# EasyEDA Pro project can-mcu.eprj, board host-network-display
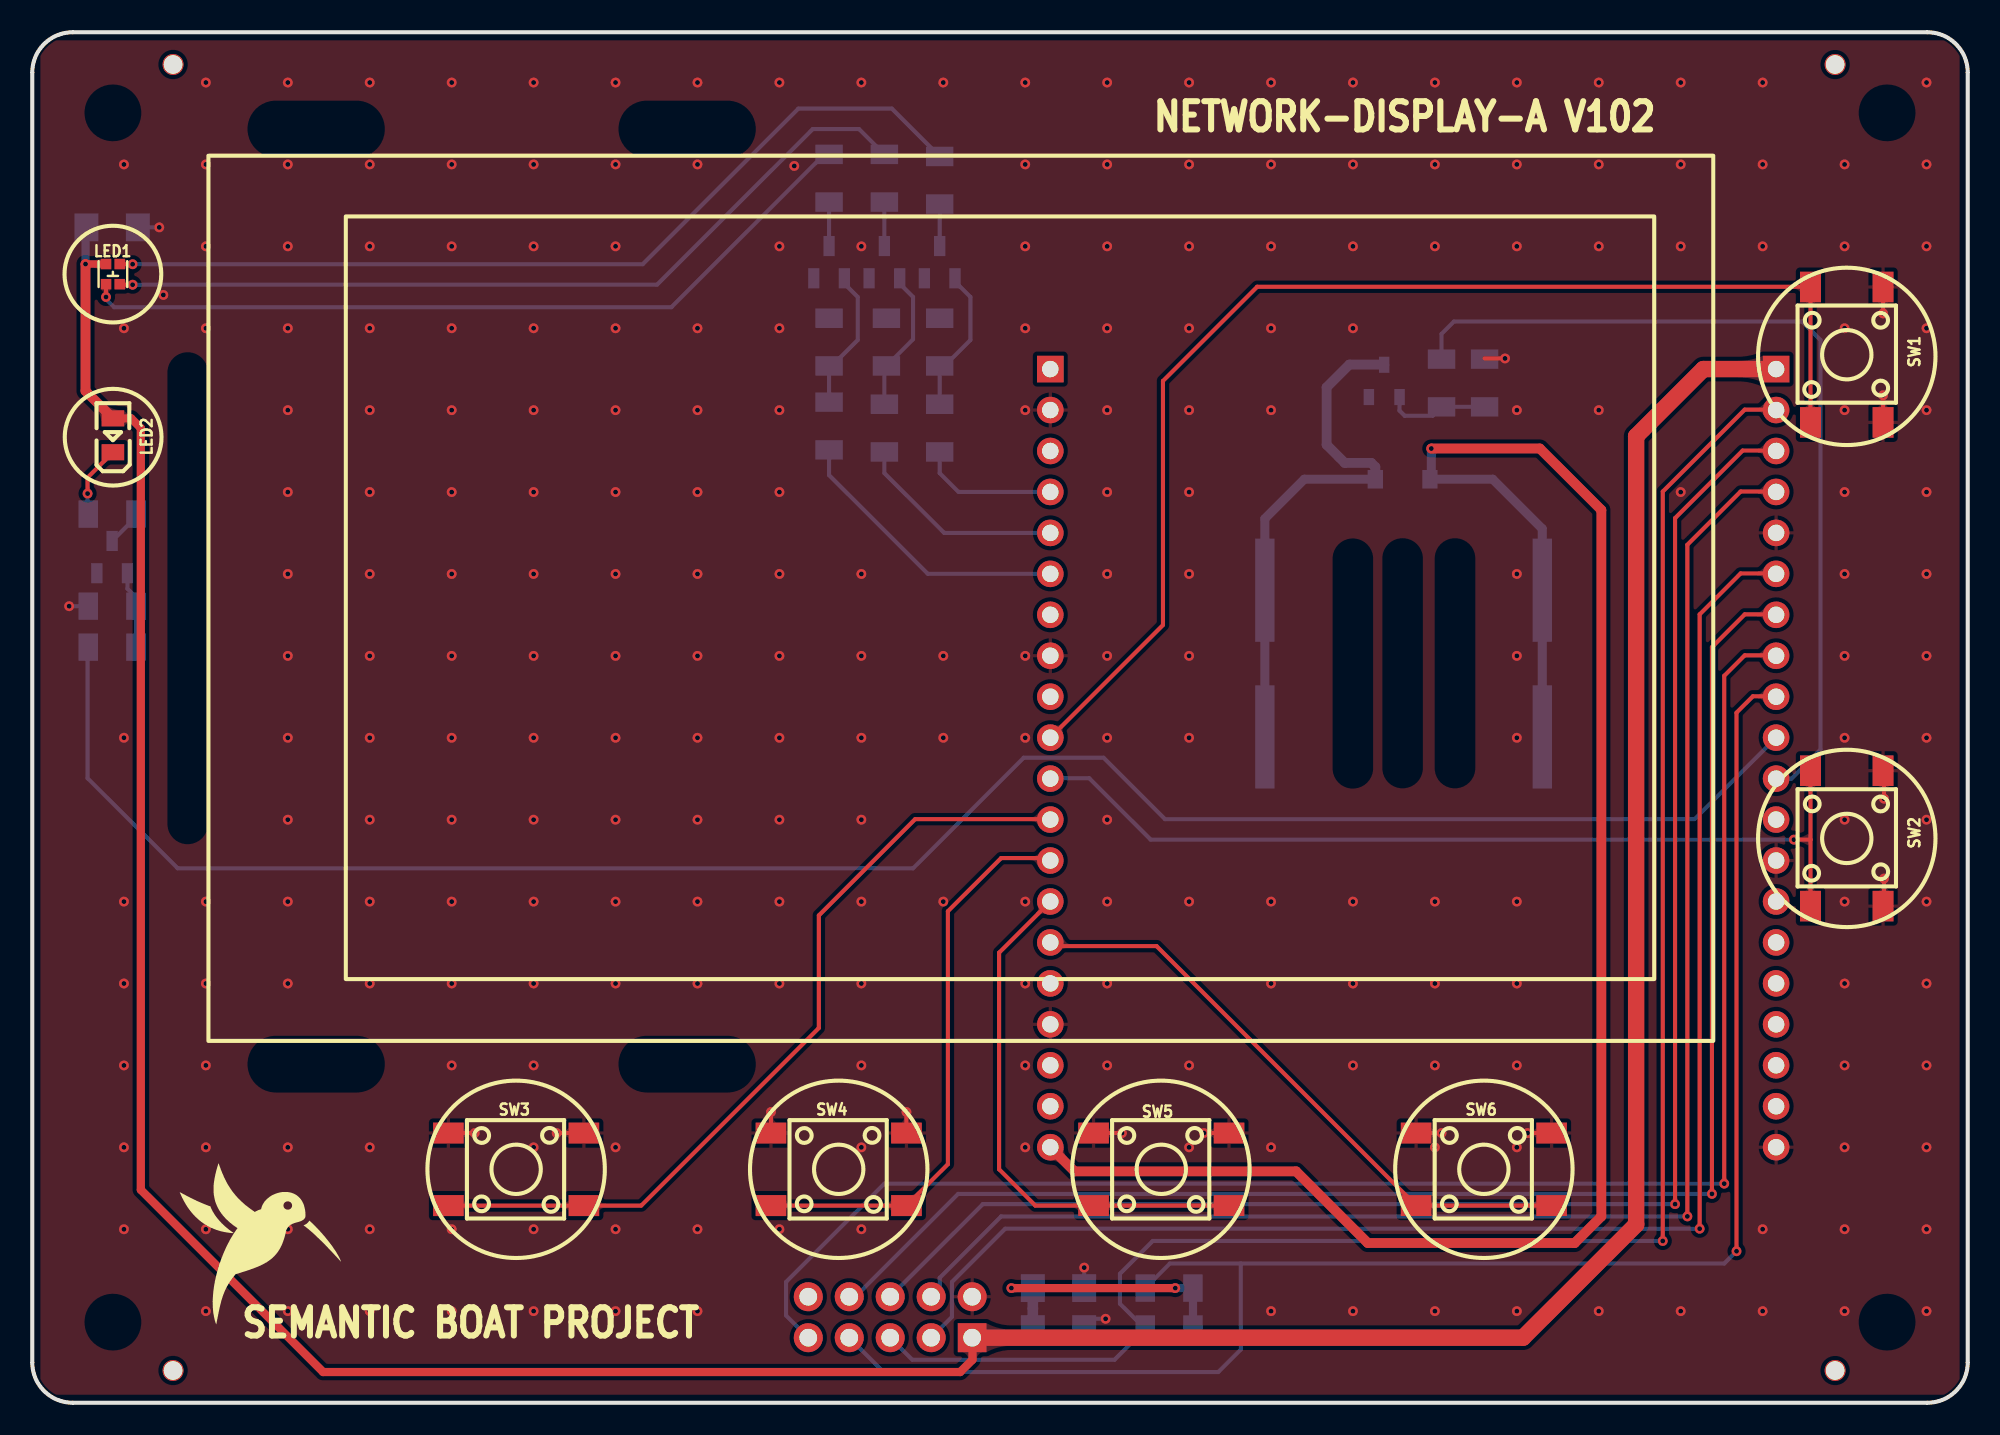
[diagram p9: board, top side]
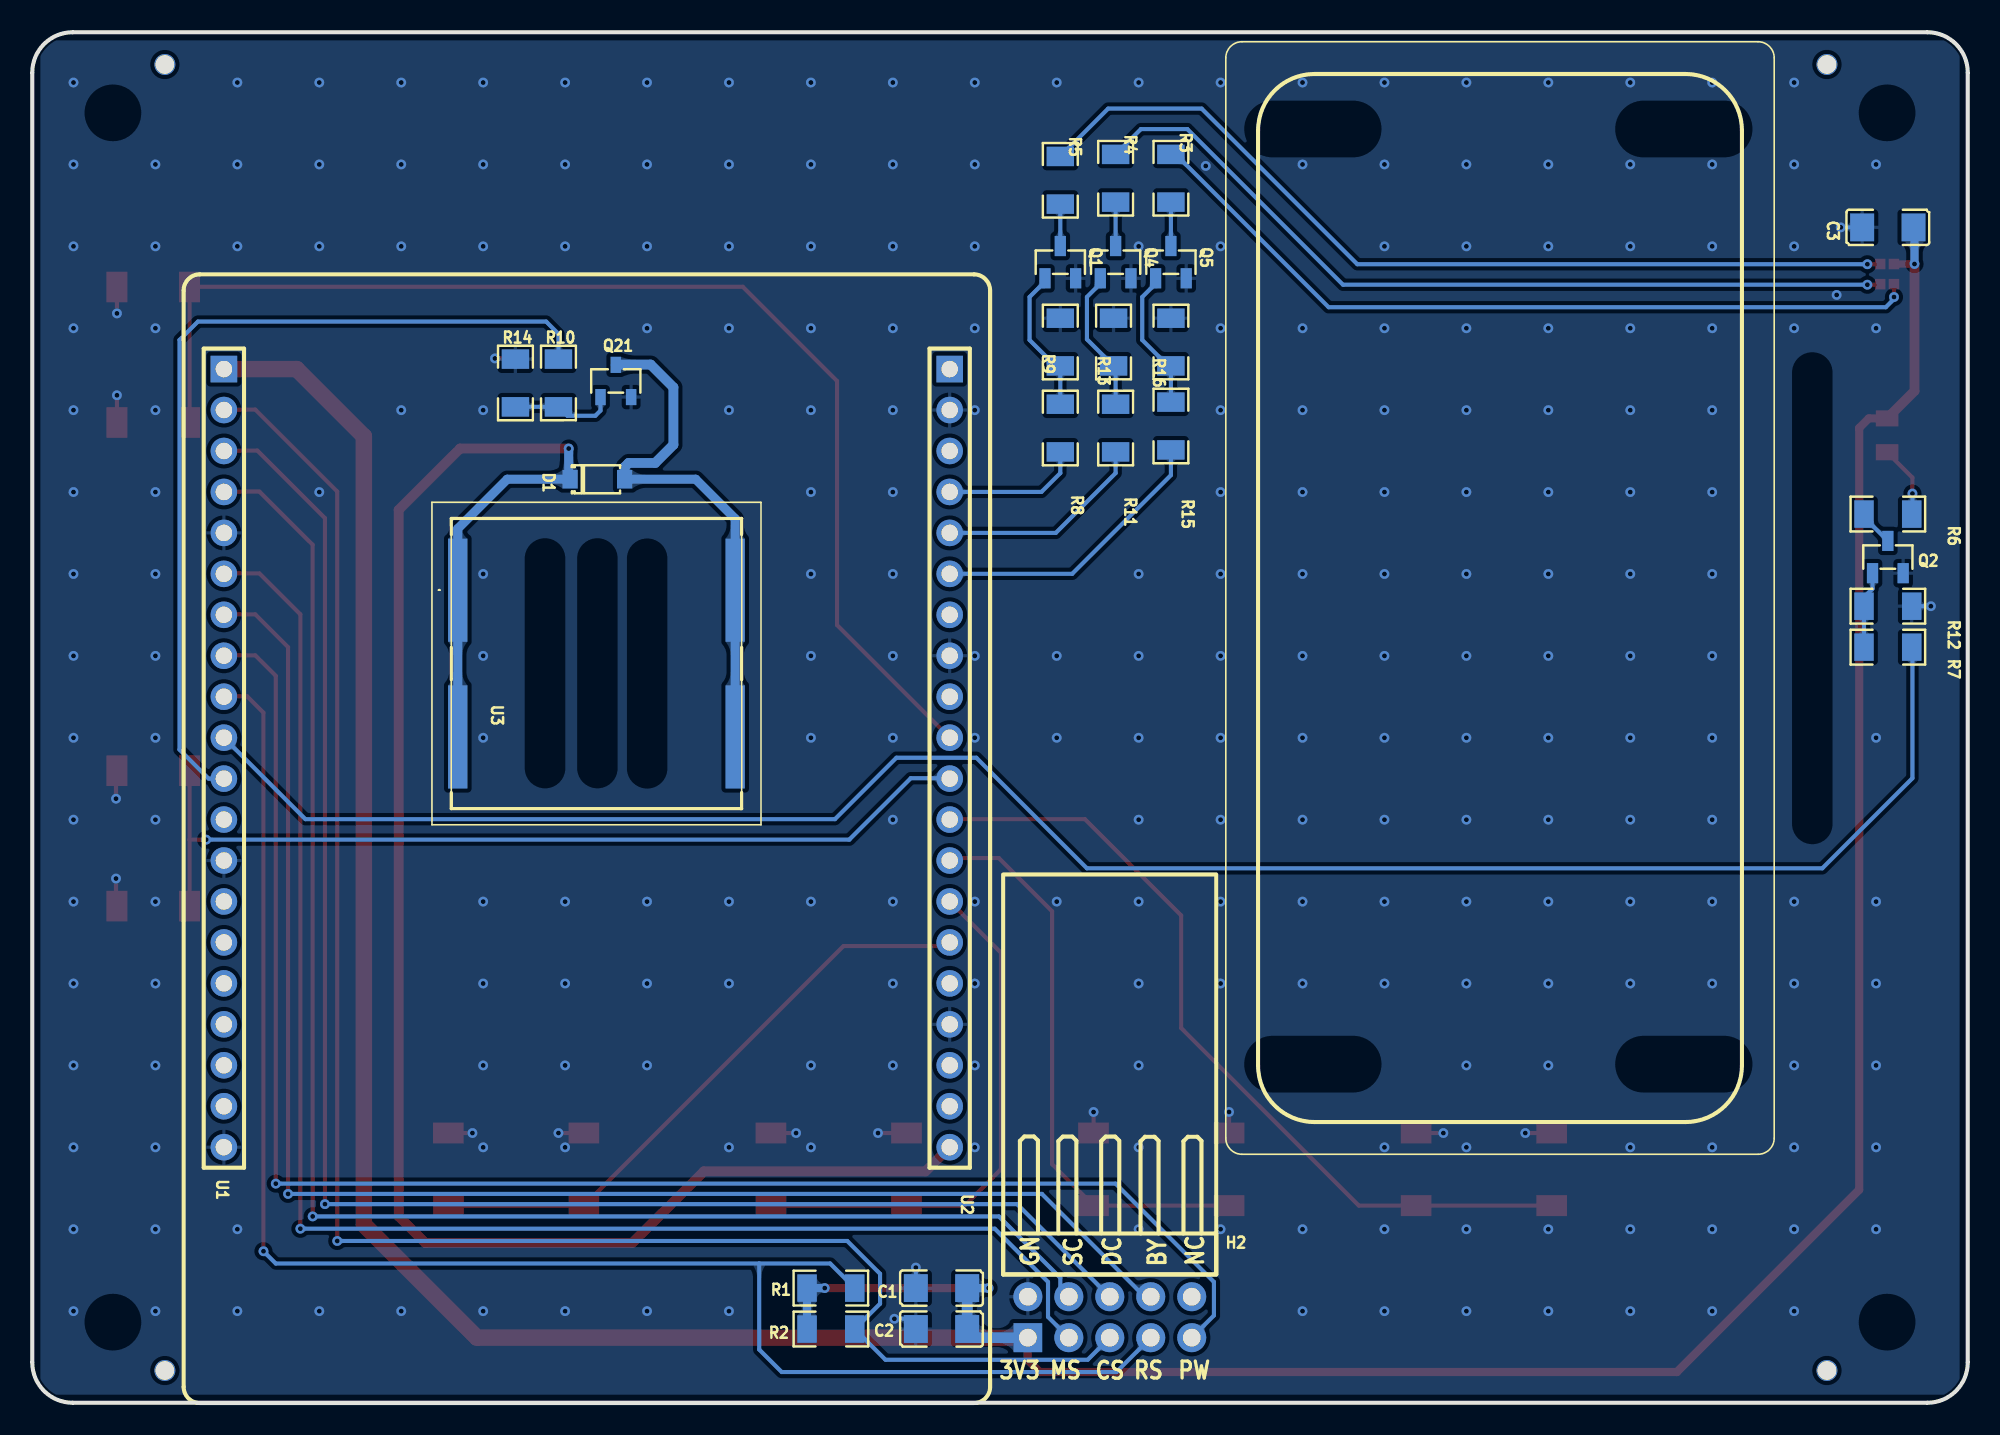
[diagram p10: board, bottom side, seen from below]

Outline 120 x 85 mm; copper layers: Top Layer, Inner1, Inner2, Bottom Layer. Coordinates in mm from the lower left corner of the outline.
Outline path: 0,82.5 0,2.5 arc(0.73,0.73) 2.5,0 117.5,0 arc(119.27,0.73) 120,2.5 120,82.5 arc(119.27,84.27) 117.5,85 2.5,85 arc(0.73,84.27) 0,82.5
Stack: Top Layer 0.035mm Outer layer thickness 1oz / Dielectric1 0.2104mm 7628 RC49% 8.6mil / Inner1 0.0152mm Inner layer thickness / Dielectric2 1.065mm 1.1mm H/HOZ Copper / Inner2 0.0152mm Inner layer thickness / Dielectric3 0.2104mm 7628 RC49% 8.6mil / Bottom Layer 0.035mm Outer layer thickness 1oz

## Design rules (mm)
template: JLCPCB Capability(Two Layers Board)
spacing copperThickness1oz (default): track to track 0.102, other pairs 0.152 to 0.3
spacing copperThickness2oz: track to track 0.203, other pairs 0.152 to 0.3
track width copperThickness1oz (default): min 0.127, default 0.254, max 2.54
track width copperThickness2oz: min 0.203, default 0.254, max 2.54
differential pair differentialPair (default): width min 0.127, default 0.254, max 2.54; gap min 0.152, default 0.152
via viaSize (default): diameter min 0.5, default 0.61, max 10; hole min 0.3, default 0.305, max 6.3

## Placement (name value [footprint] x y rotation side)
C1  100nF  [C1206]  63.63 7.11 0 bottom
C2  22uF  [C1206]  63.63 4.57 0 bottom
C3  100nF  [C1206]  4.95 72.9 0 bottom
D1  1N4148W  [SOD-123_L2.8-W1.8-LS3.7-RD]  84.96 57.28 180 bottom
H2  PZ254R-12-10P  [HDR-TH_10P-P2.54-H-M-R2-C5-S2.54]  53.19 5.31 180 bottom
LED1  SZYY1615RGB-B 4pin  [LED-SMD_4P-L1.6-W1.5-TR-1]  5 70 0 top
LED2  KT-0805G  [LED0805-R-RD]  5 60 90 top
NOREF  -  [Pad_e112]  111.78 83 0 top
NOREF#2  -  [Pad_e111]  111.78 2 0 top
NOREF#3  -  [Pad_e96]  8.73 2 0 top
NOREF#4  -  [Pad_e110]  8.73 83 0 top
Q1  2N7002  [SOT-23-3_L2.9-W1.3-P1.90-LS2.4-BR]  56.26 70.74 270 bottom
Q2  2N7002  [SOT-23-3_L2.9-W1.3-P1.90-LS2.4-BR]  4.95 52.45 270 bottom
Q4  2N7002  [SOT-23-3_L2.9-W1.3-P1.90-LS2.4-BR]  52.83 70.74 270 bottom
Q5  2N7002  [SOT-23-3_L2.9-W1.3-P1.90-LS2.4-BR]  49.4 70.74 270 bottom
Q21  AO3400A  [SOT-23-3_L2.9-W1.3-P1.90-LS2.4-BR#2]  83.82 63.37 270 bottom
R1  10kΩ  [R1206]  70.49 7.11 0 bottom
R2  10kΩ  [R1206]  70.49 4.57 0 bottom
R3  100Ω  [R1206]  49.4 75.95 90 bottom
R4  100Ω  [R1206]  52.83 75.95 90 bottom
R5  150Ω  [R1206]  56.26 75.82 90 bottom
R6  100Ω  [R1206]  4.95 55.12 180 bottom
R7  100Ω  [R1206]  4.95 46.86 180 bottom
R8  100Ω  [R1206]  56.26 60.45 270 bottom
R9  100kΩ  [R1206]  56.26 65.79 90 bottom
R10  220Ω  [R1206]  87.38 63.25 270 bottom
R11  100Ω  [R1206]  52.83 60.45 90 bottom
R12  100kΩ  [R1206]  4.95 49.4 180 bottom
R13  100kΩ  [R1206]  52.96 65.79 90 bottom
R14  47kΩ  [R1206]  90.04 63.25 270 bottom
R15  100Ω  [R1206]  49.4 60.58 90 bottom
R16  100kΩ  [R1206]  49.4 65.79 90 bottom
SW1  TS-1002S-05026C  [KEY-SMD_4P-L6.0-W6.0-P4.50-LS9.0]  112.5 65 270 top
SW2  TS-1002S-05026C  [KEY-SMD_4P-L6.0-W6.0-P4.50-LS9.0]  112.5 35 270 top
SW3  TS-1002S-05026C  [KEY-SMD_4P-L6.0-W6.0-P4.50-LS9.0]  30 14.48 0 top
SW4  TS-1002S-05026C  [KEY-SMD_4P-L6.0-W6.0-P4.50-LS9.0]  50 14.48 0 top
SW5  TS-1002S-05026C  [KEY-SMD_4P-L6.0-W6.0-P4.50-LS9.0]  70 14.48 0 top
SW6  TS-1002S-05026C  [KEY-SMD_4P-L6.0-W6.0-P4.50-LS9.0]  90 14.48 0 top
U1  KH-2.54FH-1X20P-H8.5  [HDR-TH_20P-P2.54-V-F-2]  108.12 39.98 270 bottom
U2  KH-2.54FH-1X20P-H8.5  [HDR-TH_20P-P2.54-V-F-2]  63.12 39.98 270 bottom
U3  PKMCS1818E20A0-R1  [PKMCS1818E20A0R1]  85.02 45.85 180 bottom

## Footprints (pads in the part's own frame, mm; a bottom-side part is the same pattern mirrored in y, then rotated)
C1206
  rect 1.485x1.728 smd: 1(-1.593,0) 2(1.593,0)
HDR-TH_10P-P2.54-H-M-R2-C5-S2.54
  rect 1.778x1.8 hole 1.1: 1(-5.08,-1.27)
  round 1.8 hole 1.1: 2(-5.08,1.27) 3(-2.54,-1.27) 4(-2.54,1.27) 5(0,-1.27) 6(0,1.27) 7(2.54,-1.27) 8(2.54,1.27) 9(5.08,-1.27) 10(5.08,1.27)
HDR-TH_20P-P2.54-V-F-2
  rect 1.65x1.65 hole 1.02: 1(-24.13,0)
  round 1.65 hole 1.02: 2(-21.59,0) 3(-19.05,0) 4(-16.51,0) 5(-13.97,0) 6(-11.43,0) 7(-8.89,0) 8(-6.35,0) 9(-3.81,0) 10(-1.27,0) 11(1.27,0) 12(3.81,0) 13(6.35,0) 14(8.89,0) 15(11.43,0) 16(13.97,0) 17(16.51,0) 18(19.05,0) 19(21.59,0) 20(24.13,0)
KEY-SMD_4P-L6.0-W6.0-P4.50-LS9.0
  rect 1.9x1.3 smd: 1(-4.2,2.25) 2(4.2,2.25) 3(-4.2,-2.25) 4(4.2,-2.25)
LED0805-R-RD
  rect 1x1.399 smd: 1(1.05,0) 2(-1.05,0)
LED-SMD_4P-L1.6-W1.5-TR-1
  rect 0.65x0.65 smd: 1(0.425,0.625) 2(0.425,-0.625) 3(-0.425,-0.625) 4(-0.425,0.625)
Pad_e96
  round 1.3 hole 1.152: 1(0,0)
Pad_e110
  round 1.3 hole 1.152: 1(0,0)
Pad_e111
  round 1.3 hole 1.152: 1(0,0)
Pad_e112
  round 1.3 hole 1.152: 1(0,0)
PKMCS1818E20A0R1
  rect 1.2x6.4 smd: 1(-8.6,4.55) 2(-8.6,-4.55) 3(8.6,-4.55) 4(8.6,4.55)
R1206
  rect 1.208x1.701 smd: 1(-1.479,0) 2(1.479,0)
SOD-123_L2.8-W1.8-LS3.7-RD
  rect 0.95x1.15 smd: 1(-1.692,0) 2(1.692,0)
SOT-23-3_L2.9-W1.3-P1.90-LS2.4-BR
  rect 1.25x0.7 smd: 1(1,-0.95) 2(1,0.95) 3(-1,0)
SOT-23-3_L2.9-W1.3-P1.90-LS2.4-BR#2
  rect 1x0.65 smd: 1(1,-0.95) 2(1,0.95) 3(-1,0)

## Nets
As in the schematic.

Pads without a net: H2 10; NOREF 1; NOREF#2 1; NOREF#3 1; NOREF#4 1; U1 12 14 15 16 17 18 19; U2 1 3 7 9 16 18 19

## Via types
v1: diameter 0.61, hole 0.305, Top Layer to Bottom Layer, 288 vias

## Routing (per net, layer and track width the routed paths; a pad name or vN(x,y) marks a point on that pad's centre or on a via; arc(x,y) is an arc through that point)
+3V3: length 246
  Top Layer w0.457: LED1.4 v1(3.3,70.62)
  Top Layer w0.508: v1(70.87,7.11) v1(60.71,7.11) ; H2.1 58.29,4.02 58.29,2.67 57.53,1.91 18.03,1.91 6.73,13.21 6.73,60.45 6.13,61.05 LED2.1
  Top Layer w0.61: v1(3.3,70.62) 3.3,62.75 LED2.1
  Top Layer w1.016: H2.1 92.43,4.04 99.44,11.05 99.44,59.94 103.61,64.11 U1.1
  Bottom Layer w0.254: 62.04,5.84 62.03,5.85
  Bottom Layer w0.508: v1(3.3,70.62) 3.3,72.84 C3.1 ; R2.2 R1.2 v1(70.87,7.11) ; v1(60.71,7.11) C1.1
  Bottom Layer w0.66: H2.1 61.5,4.04 C2.1 C1.1
+12V: length 116.3
  Top Layer w0.61: U2.20 64.62,14.35 78.36,14.35 82.8,9.91 95.63,9.91 97.28,11.56 97.28,55.37 93.47,59.18 v1(86.74,59.18)
  Bottom Layer w0.559: U3.2 U3.1 93.62,54.21 90.55,57.28 D1.1 86.74,57.36 v1(86.74,59.18)
GND: length 25.8
  Top Layer w0.254: 90.04,64.77 v1(91.31,64.77) ; v1(114.81,32.51) 114.81,30.86 SW2.2 ; SW5.2 v1(72.64,16.73) ; v1(114.75,67.56) SW1.1 ; SW3.2 v1(32.51,16.73) ; SW3.1 v1(27.43,16.73) ; SW2.1 114.81,39.14 v1(114.81,37.47) ; SW4.1 v1(45.8,18.03) ; SW4.2 v1(54.2,18.03) ; SW6.2 v1(92.71,16.73) ; SW6.1 v1(87.38,16.73) ; v1(114.75,62.48) SW1.2 ; SW5.1 v1(67.56,16.73)
  Bottom Layer w0.254: C3.2 v1(7.87,72.9) ; v1(66.55,5.21) 65.85,5.21 C2.2 ; R12.2 v1(2.29,49.4) ; C1.2 v1(65.22,8.38)
  vias: v1(5.68,76.8) v1(5.68,66.64) v1(5.68,41.24) v1(5.68,31.08) v1(5.68,26) v1(5.68,20.92) v1(5.68,15.84) v1(5.68,10.76) v1(8.13,68.71) v1(10.76,81.88) v1(10.76,76.8) v1(10.76,71.72) v1(10.76,66.64) v1(10.76,31.08) v1(10.76,26) v1(10.76,20.92) v1(10.76,15.84) v1(10.76,10.76) v1(10.76,5.68) v1(15.84,81.88) v1(15.84,76.8) v1(15.84,71.72) v1(15.84,66.64) v1(15.84,61.56) v1(15.84,56.48) v1(15.84,51.4) v1(15.84,46.32) v1(15.84,41.24) v1(15.84,36.16) v1(15.84,31.08) v1(15.84,26) v1(15.84,15.84) v1(15.84,10.76) v1(15.84,5.68) v1(20.92,81.88) v1(20.92,76.8) v1(20.92,71.72) v1(20.92,66.64) v1(20.92,61.56) v1(20.92,56.48) v1(20.92,51.4) v1(20.92,46.32) v1(20.92,41.24) v1(20.92,36.16) v1(20.92,31.08) v1(20.92,26) v1(20.92,15.84) v1(20.92,10.76) v1(20.92,5.68) v1(26,81.88) v1(26,76.8) v1(26,71.72) v1(26,66.64) v1(26,61.56) v1(26,56.48) v1(26,51.4) v1(26,46.32) v1(26,41.24) v1(26,36.16) v1(26,31.08) v1(26,26) v1(26,20.92) v1(26,10.76) v1(26,5.68) v1(31.08,81.88) v1(31.08,76.8) v1(31.08,71.72) v1(31.08,66.64) v1(31.08,61.56) v1(31.08,56.48) v1(31.08,51.4) v1(31.08,46.32) v1(31.08,41.24) v1(31.08,36.16) v1(31.08,31.08) v1(31.08,26) v1(31.08,20.92) v1(31.08,15.84) v1(31.08,10.76) v1(31.08,5.68) v1(36.16,81.88) v1(36.16,76.8) v1(36.16,71.72) v1(36.16,66.64) v1(36.16,61.56) v1(36.16,56.48) v1(36.16,51.4) v1(36.16,46.32) v1(36.16,41.24) v1(36.16,36.16) v1(36.16,31.08) v1(36.16,26) v1(36.16,15.84) v1(36.16,10.76) v1(36.16,5.68) v1(41.24,81.88) v1(41.24,76.8) v1(41.24,66.64) v1(41.24,61.56) v1(41.24,56.48) v1(41.24,51.4) v1(41.24,46.32) v1(41.24,41.24) v1(41.24,36.16) v1(41.24,31.08) v1(41.24,26) v1(41.24,10.76) v1(41.24,5.68) v1(46.32,81.88) v1(46.32,71.72) v1(46.32,66.64) v1(46.32,61.56) v1(46.32,56.48) v1(46.32,51.4) v1(46.32,46.32) v1(46.32,41.24) v1(46.32,36.16) v1(46.32,31.08) v1(46.32,26) v1(46.32,10.76) v1(47.24,76.71) v1(51.4,81.88) v1(51.4,71.72) v1(51.4,51.4) v1(51.4,46.32) v1(51.4,41.24) v1(51.4,36.16) v1(51.4,31.08) v1(51.4,26) v1(51.4,20.92) v1(51.4,15.84) v1(51.4,10.76) v1(56.48,81.88) v1(56.48,46.32) v1(56.48,41.24) v1(56.48,31.08) v1(61.56,81.88) v1(61.56,76.8) v1(61.56,71.72) v1(61.56,66.64) v1(61.56,61.56) v1(61.56,46.32) v1(61.56,41.24) v1(61.56,31.08) v1(61.56,26) v1(61.56,20.92) v1(61.56,15.84) v1(66.64,81.88) v1(66.64,76.8) v1(66.64,71.72) v1(66.64,66.64) v1(66.64,61.56) v1(66.64,56.48) v1(66.64,51.4) v1(66.64,46.32) v1(66.64,41.24) v1(66.64,36.16) v1(66.64,31.08) v1(66.64,26) v1(66.64,20.92) v1(71.72,81.88) v1(71.72,76.8) v1(71.72,71.72) v1(71.72,66.64) v1(71.72,61.56) v1(71.72,56.48) v1(71.72,51.4) v1(71.72,46.32) v1(71.72,41.24) v1(71.72,31.08) v1(71.72,20.92) v1(71.72,15.84) v1(76.8,81.88) v1(76.8,76.8) v1(76.8,71.72) v1(76.8,66.64) v1(76.8,61.56) v1(76.8,31.08) v1(76.8,26) v1(76.8,15.84) v1(76.8,5.68) v1(81.88,81.88) v1(81.88,76.8) v1(81.88,71.72) v1(81.88,66.64) v1(81.88,31.08) v1(81.88,26) v1(81.88,20.92) v1(81.88,5.68) v1(86.96,81.88) v1(86.96,76.8) v1(86.96,71.72) v1(86.96,31.08) v1(86.96,26) v1(86.96,20.92) v1(86.96,15.84) v1(86.96,5.68) v1(92.04,81.88) v1(92.04,76.8) v1(92.04,71.72) v1(92.04,61.56) v1(92.04,51.4) v1(92.04,46.32) v1(92.04,41.24) v1(92.04,31.08) v1(92.04,26) v1(92.04,20.92) v1(92.04,15.84) v1(92.04,5.68) v1(97.12,81.88) v1(97.12,76.8) v1(97.12,71.72) v1(97.12,61.56) v1(97.12,5.68) v1(102.2,81.88) v1(102.2,76.8) v1(102.2,71.72) v1(102.2,56.48) v1(102.2,5.68) v1(107.28,81.88) v1(107.28,76.8) v1(107.28,71.72) v1(107.28,10.76) v1(107.28,5.68) v1(112.36,76.8) v1(112.36,71.72) v1(112.36,66.64) v1(112.36,61.56) v1(112.36,56.48) v1(112.36,51.4) v1(112.36,46.32) v1(112.36,41.24) v1(112.36,36.16) v1(112.36,31.08) v1(112.36,26) v1(112.36,20.92) v1(112.36,15.84) v1(112.36,10.76) v1(112.36,5.68) v1(117.44,81.88) v1(117.44,76.8) v1(117.44,71.72) v1(117.44,66.64) v1(117.44,61.56) v1(117.44,56.48) v1(117.44,51.4) v1(117.44,46.32) v1(117.44,41.24) v1(117.44,36.16) v1(117.44,31.08) v1(117.44,26) v1(117.44,20.92) v1(117.44,15.84) v1(117.44,10.76) v1(117.44,5.68)
BTN_FUN_0: length 76
  Top Layer w0.254: U2.10 70.1,48.23 70.1,63.37 75.95,69.22 110.24,69.22 SW1.3 SW1.4
BTN_FUN_1: length 57.1
  Top Layer w0.254: SW2.3 110.25,34.92 ; 110.25,34.92 v1(109.22,34.92) ; 110.25,34.92 SW2.4
  Bottom Layer w0.254: U2.11 63.14,38.73 65.53,38.73 69.34,34.92 v1(109.22,34.92)
BTN_FUN_2: length 51.3
  Top Layer w0.254: U2.12 63.09,36.19 54.74,36.19 48.77,30.23 48.77,23.24 37.75,12.23 SW3.4 SW3.3
BTN_FUN_3: length 35.5
  Top Layer w0.254: U2.13 62.97,33.78 60.07,33.78 56.77,30.48 56.77,14.8 SW4.4 SW4.3
BTN_FUN_4: length 33.1
  Top Layer w0.254: SW5.4 SW5.3 62.19,12.23 59.94,14.48 59.94,27.91 U2.14
BTN_FUN_5: length 37.8
  Top Layer w0.254: SW6.4 SW6.3 69.71,28.32 63.35,28.32 U2.15
GPIO_PA2_T23: length 121.7
  Bottom Layer w0.254: U1.10 103.06,36.19 70.23,36.19 66.42,40 61.47,40 54.61,33.15 9.02,33.15 3.43,38.73 3.43,46.82 R7.2
GPIO_PA3_T24: length 54.8
  Bottom Layer w0.254: R10.1 87.38,66.29 88.14,67.06 109.73,67.06 110.87,65.91 110.87,40.51 109.07,38.71 U1.11
GPIO_PA4_D_CS: length 111.4
  Top Layer w0.254: U1.2 108.09,61.59 106.17,61.59 101.09,56.52 v1(101.09,10.03)
  Bottom Layer w0.254: v1(101.09,10.03) 69.47,10.03 67.44,8 67.44,6.14 R2.1 67.1,2.67 54.56,2.67 H2.5
GPIO_PA5_D_SCK: length 97.9
  Top Layer w0.254: U1.4 108.09,56.52 105.92,56.52 102.62,53.21 v1(102.62,11.56)
  Bottom Layer w0.254: v1(102.62,11.56) 60.07,11.56 56.26,7.75 56.26,7.1 H2.4
GPIO_PA6_D_DC: length 101.6
  Top Layer w0.254: U1.3 108.09,59.06 106.04,59.06 101.85,54.86 v1(101.85,12.32)
  Bottom Layer w0.254: v1(101.85,12.32) 58.94,12.32 H2.6
GPIO_PA7_D_MOSI: length 95.6
  Top Layer w0.254: U1.6 108.09,51.44 105.92,51.44 103.38,48.89 v1(103.38,10.79)
  Bottom Layer w0.254: v1(103.38,10.79) 60.32,10.79 57.02,7.49 57.02,5.33 H2.3
GPIO_PA8_T11: length 8.7
  Bottom Layer w0.254: U2.4 57.43,56.49 56.26,57.66 R8.2
GPIO_PA9_T12: length 13.1
  Bottom Layer w0.254: R11.1 52.83,57.66 56.54,53.95 U2.5
GPIO_PA10_T13: length 17.8
  Bottom Layer w0.254: R15.1 49.4,57.53 55.52,51.41 U2.6
GPIO_PB12_D_BUSY: length 94.9
  Top Layer w0.254: v1(104.14,12.95) 104.14,46.86 106.17,48.89 108.09,48.89 U1.7
  Bottom Layer w0.254: v1(104.14,12.95) 57.4,12.95 51.03,6.58 H2.8
GPIO_PB13_D_PWR: length 100
  Top Layer w0.254: v1(104.9,13.59) 104.9,45.08 106.17,46.36 108.09,46.36 U1.8
  Bottom Layer w0.254: H2.9 46.74,5.41 46.74,7.49 52.83,13.59 v1(104.9,13.59)
GPIO_PB14_D_RST: length 105
  Top Layer w0.254: v1(105.66,9.4) 105.66,42.8 106.68,43.81 108.09,43.81 U1.9
  Bottom Layer w0.254: H2.7 52.78,1.91 73.53,1.91 74.93,3.3 74.93,8.64 ; v1(105.66,9.4) 104.9,8.64 74.93,8.64 ; 74.93,8.64 70.53,8.64 R1.1
$1N6640: length 8.9
  Bottom Layer w0.254: R15.2 R16.1 49.57,64.31 51.18,65.91 51.18,68.58 50.35,69.41 Q5.1
$1N6642: length 8.9
  Bottom Layer w0.254: Q4.1 53.78,69.41 54.61,68.58 54.61,65.96 R13.1 52.83,64.18 R11.2
$1N6643: length 9.2
  Bottom Layer w0.254: R8.1 R9.1 56.56,64.31 58.17,65.91 58.17,68.58 57.21,69.53 57.21,69.74
$1N6645: length 2.7
  Bottom Layer w0.254: Q5.3 R3.1
$1N6646: length 2.7
  Bottom Layer w0.254: Q4.3 R4.1
$1N6648: length 52.1
  Top Layer w0.254: v1(6.22,69.34) 5.46,69.34 LED1.2
  Bottom Layer w0.254: v1(6.22,69.34) 38.74,69.34 48.39,78.99 51.26,78.99 R4.2
$1N6649: length 49.9
  Top Layer w0.254: LED1.3 4.57,69.37 v1(4.57,68.58)
  Bottom Layer w0.254: v1(4.57,68.58) 4.57,68.45 5.08,67.94 39.62,67.94 49.1,77.42 R3.2
$1N6650: length 2.6
  Bottom Layer w0.254: Q1.3 R5.1
$1N61445: length 4.8
  Bottom Layer w0.254: Q2.1 5.9,50.48 6.43,49.96 R12.1 R7.1
$1N61447: length 2.3
  Bottom Layer w0.254: R6.1 6.43,54.93 Q2.3
$1N63206: length 56.1
  Top Layer w0.254: v1(6.22,70.61) 5.44,70.61 LED1.1
  Bottom Layer w0.254: R5.2 53.29,80.26 47.5,80.26 37.85,70.61 v1(6.22,70.61)
$1N82421: length 33.5
  Bottom Layer w0.559: U3.3 U3.4 76.42,54.83 78.87,57.28 D1.2
  Bottom Layer w0.61: D1.2 83.27,58.04 83.02,58.29 81.38,58.29 80.25,59.41 80.25,62.98 81.66,64.39 83.8,64.39 Q21.3
$1N82425: length 6.5
  Bottom Layer w0.254: Q21.1 84.77,61.53 85.09,61.21 86.82,61.21 R10.2 R14.2
$1N83824: length 4.5
  Top Layer w0.254: v1(3.43,56.39) 3.43,57.38 LED2.2
  Bottom Layer w0.254: v1(3.43,56.39) 3.43,55.16 R6.2

## Copper pours and planes (outline as drawn; the poured copper is in the pictures)
GND on Top Layer: -1.78,86.49 121.79,86.49 121.79,-1.02 -1.78,-1.02
GND on Bottom Layer: -2.79,87.38 122.94,87.38 122.94,-1.91 -2.79,-1.91
GND on Inner1: -3.3,87.63 123.19,87.63 123.19,-1.78 -3.3,-1.78
GND on Inner2: -4.06,88.65 124.59,88.65 124.59,-2.67 -4.06,-2.67

Small or netless copper shapes (teardrops, artwork), in the pictures only: 83 on Top Layer, 95 on Bottom Layer

## Text on the board
Bottom Silkscreen Layer: NC | BY | DC | SC | GN | RS | CS | MS | 3V3 | PW
Top Silkscreen Layer: SEMANTIC BOAT PROJECT | NETWORK-DISPLAY-A V102
